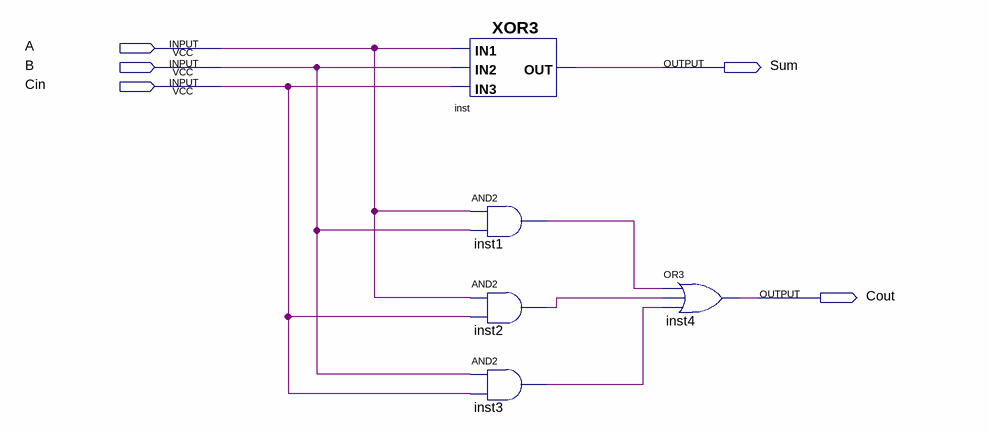
[diagram p0: schematic sheet]
// Quartus schematic FA.bdf as structural Verilog: 5 symbols, 5 pins
module FA (
  input  A,
  input  B,
  input  Cin,
  output Sum,
  output Cout
);

  wire inst1_out, inst2_out, inst3_out;

  XOR3 inst (.IN3(Cin), .IN1(A), .IN2(B), .OUT(Sum));
  and inst1 (inst1_out, A, B);
  and inst2 (inst2_out, A, Cin);
  and inst3 (inst3_out, B, Cin);
  or inst4 (Cout, inst1_out, inst2_out, inst3_out);
endmodule
